# EAGLE design supply (EAGLE 9.6.2)
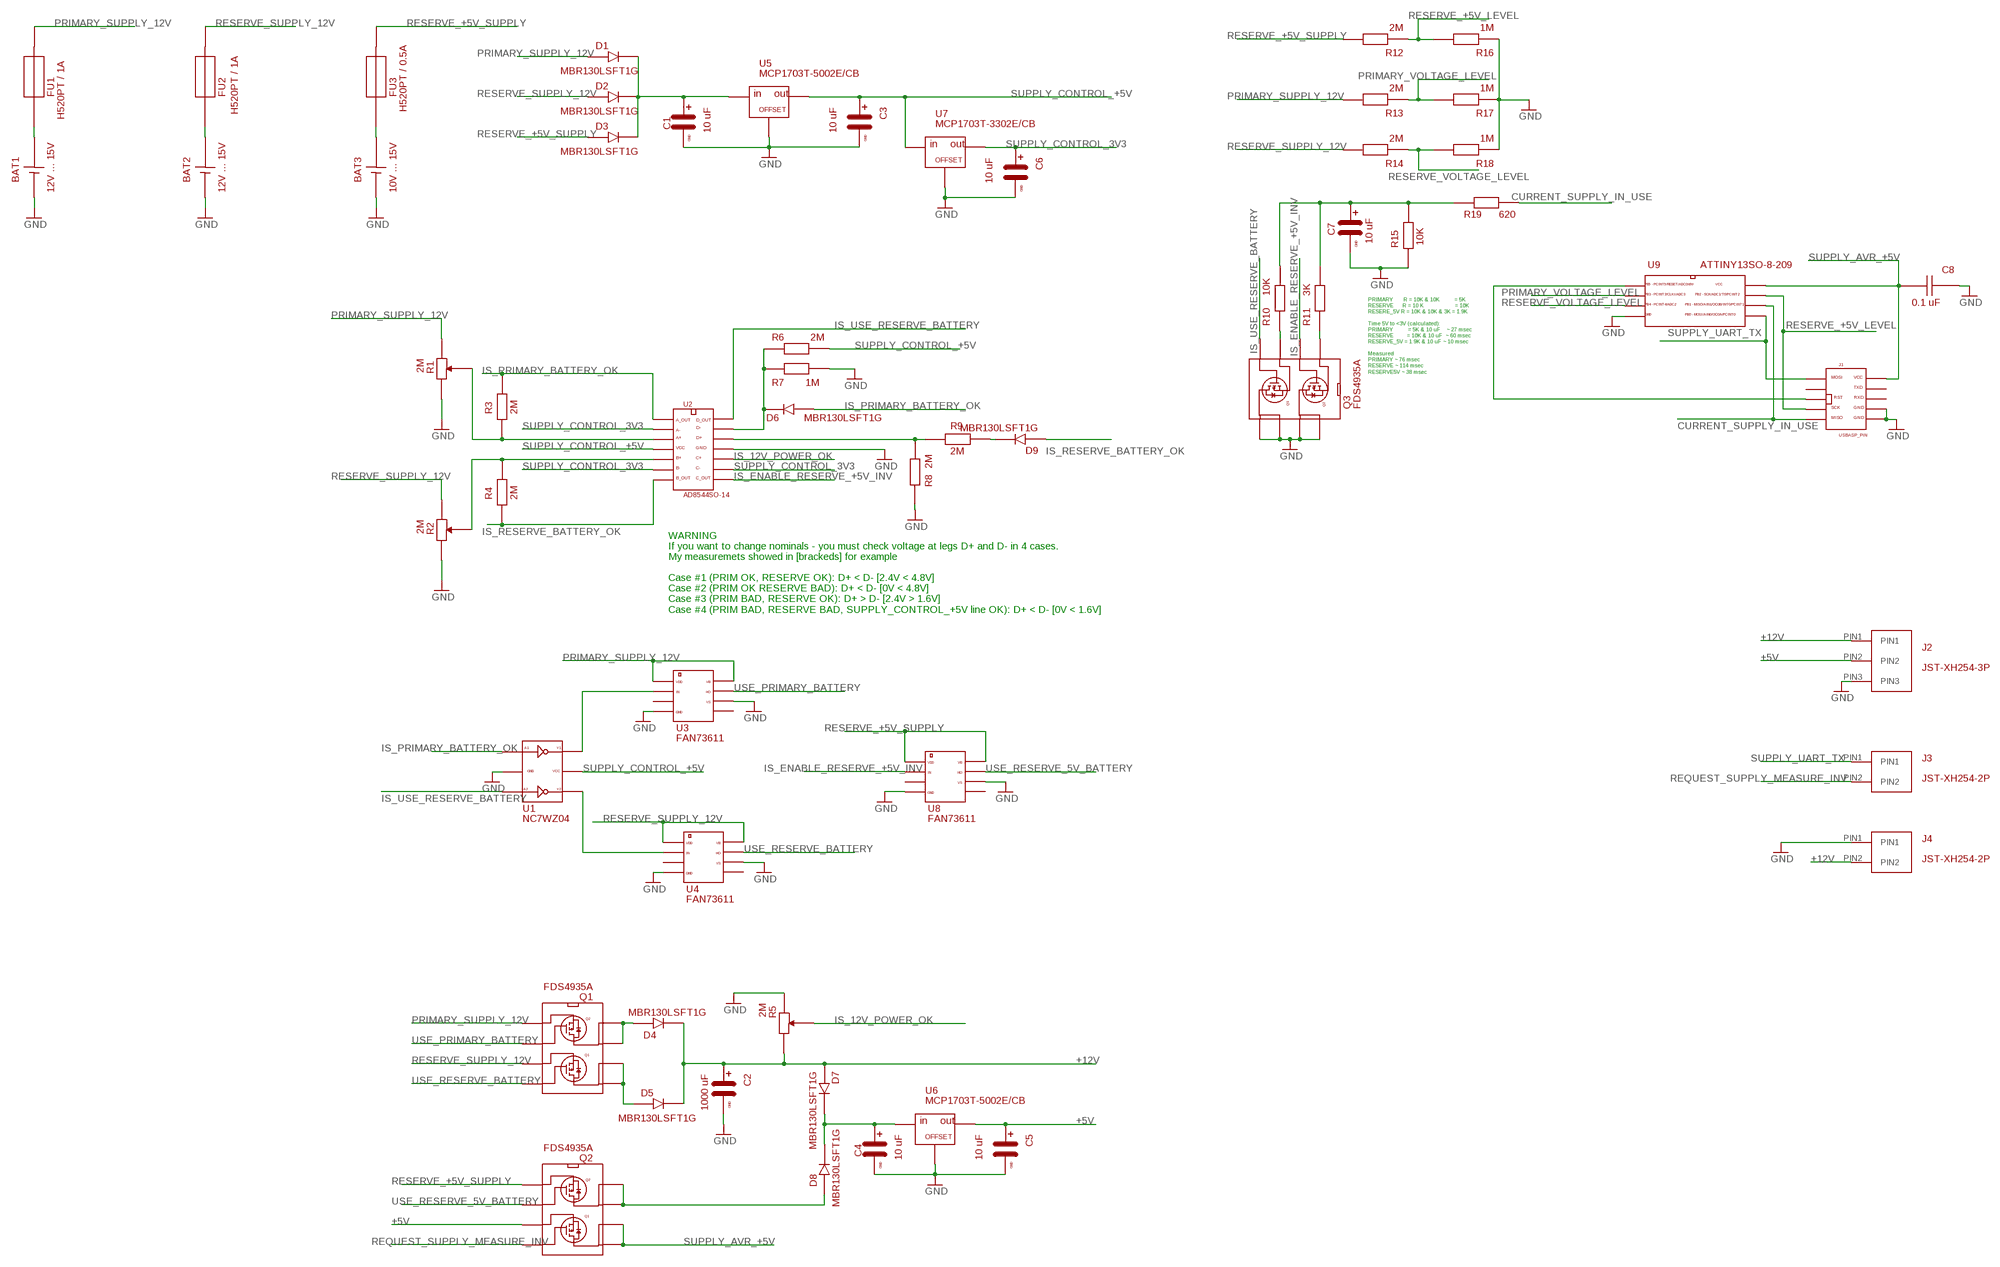
[diagram p0: schematic, sheet 1]

## Parts
BAT1  12V ... 15V  BATTERY  [BATTERY]
BAT2  12V ... 15V  BATTERY  [BATTERY]
BAT3  10V ... 15V  BATTERY  [BATTERY]
C1  10 uF  CMINI-5X7  [C-MINI-5X7]
C2  1000 uF  C  [C]
C3  10 uF  CMINI-5X7  [C-MINI-5X7]
C4  10 uF  CMINI-5X7  [C-MINI-5X7]
C5  10 uF  CMINI-5X7  [C-MINI-5X7]
C6  10 uF  CMINI-5X7  [C-MINI-5X7]
C7  10 uF  CMINI-5X7  [C-MINI-5X7]
C8  0.1 uF  C-1  [C-1]
D1  MBR130LSFT1G  DSOD-123FL  [D-SOD-123FL]
D2  MBR130LSFT1G  DSOD-123FL  [D-SOD-123FL]
D3  MBR130LSFT1G  DSOD-123FL  [D-SOD-123FL]
D4  MBR130LSFT1G  DSOD-123FL  [D-SOD-123FL]
D5  MBR130LSFT1G  DSOD-123FL  [D-SOD-123FL]
D6  MBR130LSFT1G  DSOD-123FL  [D-SOD-123FL]
D7  MBR130LSFT1G  DSOD-123FL  [D-SOD-123FL]
D8  MBR130LSFT1G  DSOD-123FL  [D-SOD-123FL]
D9  MBR130LSFT1G  DSOD-123FL  [D-SOD-123FL]
FU1  H520PT / 1A  FU  [FU]
FU2  H520PT / 1A  FU  [FU]
FU3  H520PT / 0.5A  FU  [FU]
J1  USBASP_PIN  [USBASP_PIN]
J2  JST-XH254-3P  [JST-XH254-3P]
J3  JST-XH254-2P  [JST-XH254-2P]
J4  JST-XH254-2P  [JST-XH254-2P]
Q1  FDS4935A  MOSFET_P_X2  [SO-8]
Q2  FDS4935A  MOSFET_P_X2  [SO-8]
Q3  FDS4935A  MOSFET_P_X2  [SO-8]
R1  2M  RD3296W-1-205LF  [RD-3296W-1-205LF]
R2  2M  RD3296W-1-205LF  [RD-3296W-1-205LF]
R3  2M  R  [R]
R4  2M  R  [R]
R5  2M  RD3296W-1-205LF  [RD-3296W-1-205LF]
R6  2M  R  [R]
R7  1M  R  [R]
R8  2M  R  [R]
R9  2M  R  [R]
R10  10K  R  [R]
R11  3K  R  [R]
R12  2M  R  [R]
R13  2M  R  [R]
R14  2M  R  [R]
R15  10K  R  [R]
R16  1M  R  [R]
R17  1M  R  [R]
R18  1M  R  [R]
R19  620  R  [R]
U1  NC7WZ04  INVERTER._X2  [SC70]
U2  AD8544SO-14  [SO-14]
U3  FAN73611  [SOIC-8]
U4  FAN73611  [SOIC-8]
U5  MCP1703T-5002E/CB  VOLTAGE_REGULATORSOT-23A  [SOT-23A]
U6  MCP1703T-5002E/CB  VOLTAGE_REGULATORSOT-23A  [SOT-23A]
U7  MCP1703T-3302E/CB  VOLTAGE_REGULATORSOT-23A  [SOT-23A]
U8  FAN73611  [SOIC-8]
U9  ATTINY13SO-8-209  [SO-8-209]

## Nets
+5V: C5.PLUS(PIN_PLUS) J2.PIN2 Q2.P3(S1) U6.P2(OUT)
+12V: C2.PIN_PLUS D4.CATHODE D5.CATHODE D7.ANODE J2.PIN1 J4.PIN2 R5.P2
BAT1: BAT1.PLUS FU1.P$1
BAT2: BAT2.PLUS FU2.P$1
BAT3: BAT3.PLUS FU3.P$1
CURRENT_SUPPLY_IN_USE: J1.MISO R19.P$2 U9.P6(PB1)
GND: BAT1.MINUS BAT2.MINUS BAT3.MINUS C1.MINUS(PIN_GND) C2.PIN_GND C3.MINUS(PIN_GND) C4.MINUS(PIN_GND) C5.MINUS(PIN_GND) C6.MINUS(PIN_GND) C7.MINUS(PIN_GND) C8.P$2 J1.GND J1.GND1 J2.PIN3 J4.PIN1 Q3.P5(D11) Q3.P6(D12) Q3.P7(D21) Q3.P8(D22) R1.P2 R2.P2 R5.P1 R7.P$1 R8.P$2 R15.P$1 R16.P$1 R17.P$1 R18.P$1 U1.P2(GND) U2.P11(GND) U3.P_4(GND) U3.P_6(VS) U4.P_4(GND) U4.P_6(VS) U5.P1(GND) U6.P1(GND) U7.P1(GND) U8.P_4(GND) U8.P_6(VS) U9.P4(GND)
IS_12V_POWER_OK: R5.P3 U2.P10(C+)
IS_ENABLE_RESERVE_+5V_INV: Q3.P2(G2) U2.P8(C_OUT) U8.P_2(IN)
IS_PRIMARY_BATTERY_OK: D6.ANODE R3.P$2 U1.P1(A1) U2.P1(A_OUT)
IS_RESERVE_BATTERY_OK: D9.ANODE R4.P$1 U2.P7(B_OUT)
IS_USE_RESERVE_BATTERY: Q3.P4(G1) U1.P3(A2) U2.P14(D_OUT)
N$1: C1.PLUS(PIN_PLUS) D1.CATHODE D2.CATHODE D3.CATHODE U5.P3(IN)
N$2: D6.CATHODE R6.P$2 R7.P$2 U2.P13(D-)
N$3: R1.P3 R3.P$1 U2.P3(A+)
N$5: C4.PLUS(PIN_PLUS) D7.CATHODE D8.CATHODE U6.P3(IN)
N$8: R2.P3 R4.P$2 U2.P5(B+)
N$9: R8.P$1 R9.P$1 U2.P12(D+)
N$12: D4.ANODE Q1.P7(D21) Q1.P8(D22)
N$13: D5.ANODE Q1.P5(D11) Q1.P6(D12)
N$17: J1.RST(RESET) U9.P1(PB5)
N$18: U1.P6(Y1) U3.P_2(IN)
N$19: U1.P4(Y2) U4.P_2(IN)
N$25: Q3.P3(S1) R10.P$1
N$26: D8.ANODE Q2.P7(D21) Q2.P8(D22)
N$27: Q3.P1(S2) R11.P$1
N$28: D9.CATHODE R9.P$2
N$29: C7.PLUS(PIN_PLUS) R10.P$2 R11.P$2 R15.P$2 R19.P$1
PRIMARY_SUPPLY_12V: D1.ANODE FU1.P$2 Q1.P1(S2) R1.P1 R13.P$2 U3.P_1(VDD) U3.P_8(VB)
PRIMARY_VOLTAGE_LEVEL: R13.P$1 R17.P$2 U9.P2(PB3)
REQUEST_SUPPLY_MEASURE_INV: J3.PIN2 Q2.P4(G1)
RESERVE_+5V_LEVEL: J1.SCK R12.P$1 R16.P$2 U9.P7(PB2)
RESERVE_+5V_SUPPLY: D3.ANODE FU3.P$2 Q2.P1(S2) R12.P$2 U8.P_1(VDD) U8.P_8(VB)
RESERVE_SUPPLY_12V: D2.ANODE FU2.P$2 Q1.P3(S1) R2.P1 R14.P$2 U4.P_1(VDD) U4.P_8(VB)
RESERVE_VOLTAGE_LEVEL: R14.P$1 R18.P$2 U9.P3(PB4)
SUPPLY_AVR_+5V: C8.P$1 J1.VCC Q2.P5(D11) Q2.P6(D12) U9.P8(VCC)
SUPPLY_CONTROL_3V3: C6.PLUS(PIN_PLUS) U2.P2(A-) U2.P6(B-) U2.P9(C-) U7.P2(OUT)
SUPPLY_CONTROL_+5V: C3.PLUS(PIN_PLUS) R6.P$1 U1.P5(VCC) U2.P4(VCC) U5.P2(OUT) U7.P3(IN)
SUPPLY_UART_TX: J1.MOSI J3.PIN1 U9.P5(PB0)
USE_PRIMARY_BATTERY: Q1.P2(G2) U3.P_7(HO)
USE_RESERVE_5V_BATTERY: Q2.P2(G2) U8.P_7(HO)
USE_RESERVE_BATTERY: Q1.P4(G1) U4.P_7(HO)
Unconnected: J1.NC1 J1.RXD J1.TXD U3.P_3(NC1) U3.P_5(NC2) U4.P_3(NC1) U4.P_5(NC2) U8.P_3(NC1) U8.P_5(NC2)

## Notes on the sheet
- PRIMARY       R = 10K & 10K          = 5K
  RESERVE      R = 10 K                     = 10K
  RESERE_5V R = 10K & 10K & 3K = 1.9K
  
  Time 5V to <3V (calculated): 
  PRIMARY          = 5K & 10 uF    ~ 27 msec
  RESERVE         = 10K & 10 uF  ~ 60 msec
  RESERVE_5V = 1.9K & 10 uF ~ 10 msec
  
  Measured
  PRIMARY ~ 76 msec
  RESERVE ~ 114 msec
  RESERVE5V ~ 38 msec
- WARNING
  If you want to change nominals - you must check voltage at legs D+ and D- in 4 cases.
  My measuremets showed in [brackeds] for example
  
  Case #1 (PRIM OK, RESERVE OK): D+ < D- [2.4V < 4.8V]
  Case #2 (PRIM OK RESERVE BAD): D+ < D- [0V < 4.8V]
  Case #3 (PRIM BAD, RESERVE OK): D+ > D- [2.4V > 1.6V]
  Case #4 (PRIM BAD, RESERVE BAD, SUPPLY_CONTROL_+5V line OK): D+ < D- [0V < 1.6V]

## Library data of the parts
BAT1-BAT3 = my_devices:BATTERY
C1-C7 = my_devices:C
C8 = my_devices:C-1
D1-D9 = my_devices:D
FU1-FU3 = my_devices:FU
J1 = my_devices:USBASP_PIN
J2 = my_devices:JST-XH254-3P
J3 J4 = my_devices:JST-XH254-2P
Q1-Q3 = my_devices:MOSFET_P_X2
R1 R2 R5 = my_devices:RD
R3 R4 R6-R19 = my_devices:R
U1 = my_devices:INVERTER._X2
U2 = my_devices:AD8544
U3 U4 U8 = my_devices:FAN73611
U5-U7 = my_devices:VOLTAGE_REGULATOR
U9 = my_devices:ATTINY13

## Board
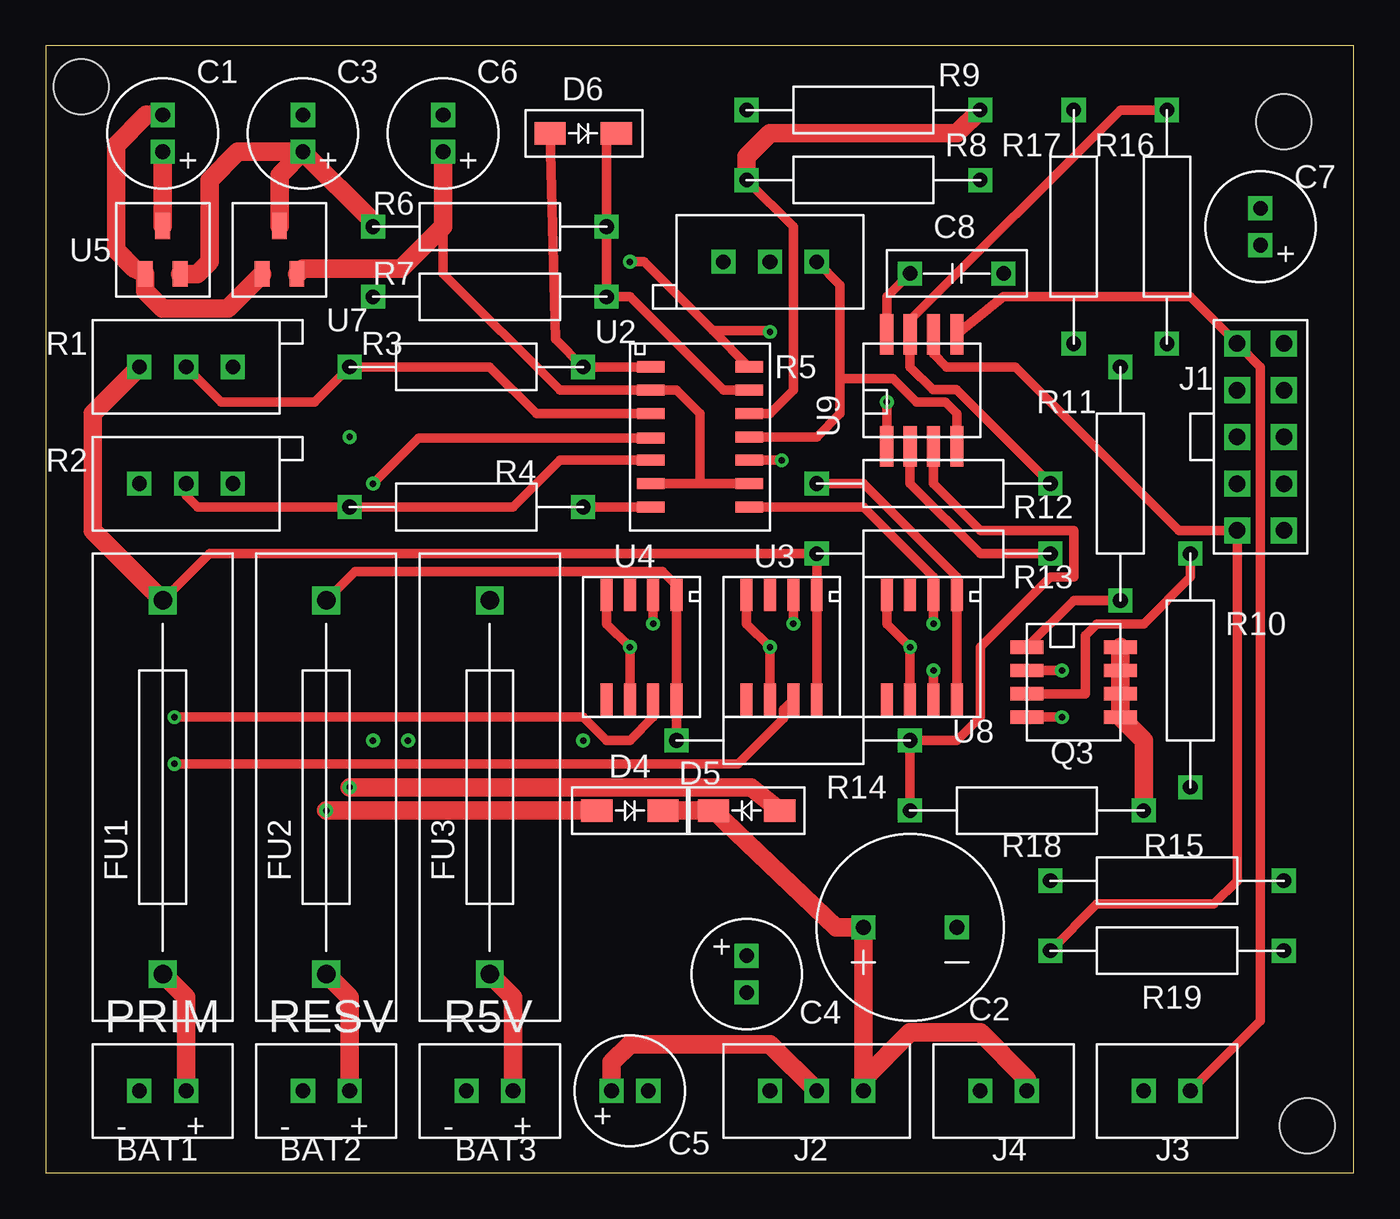
[diagram p1: board, top side]
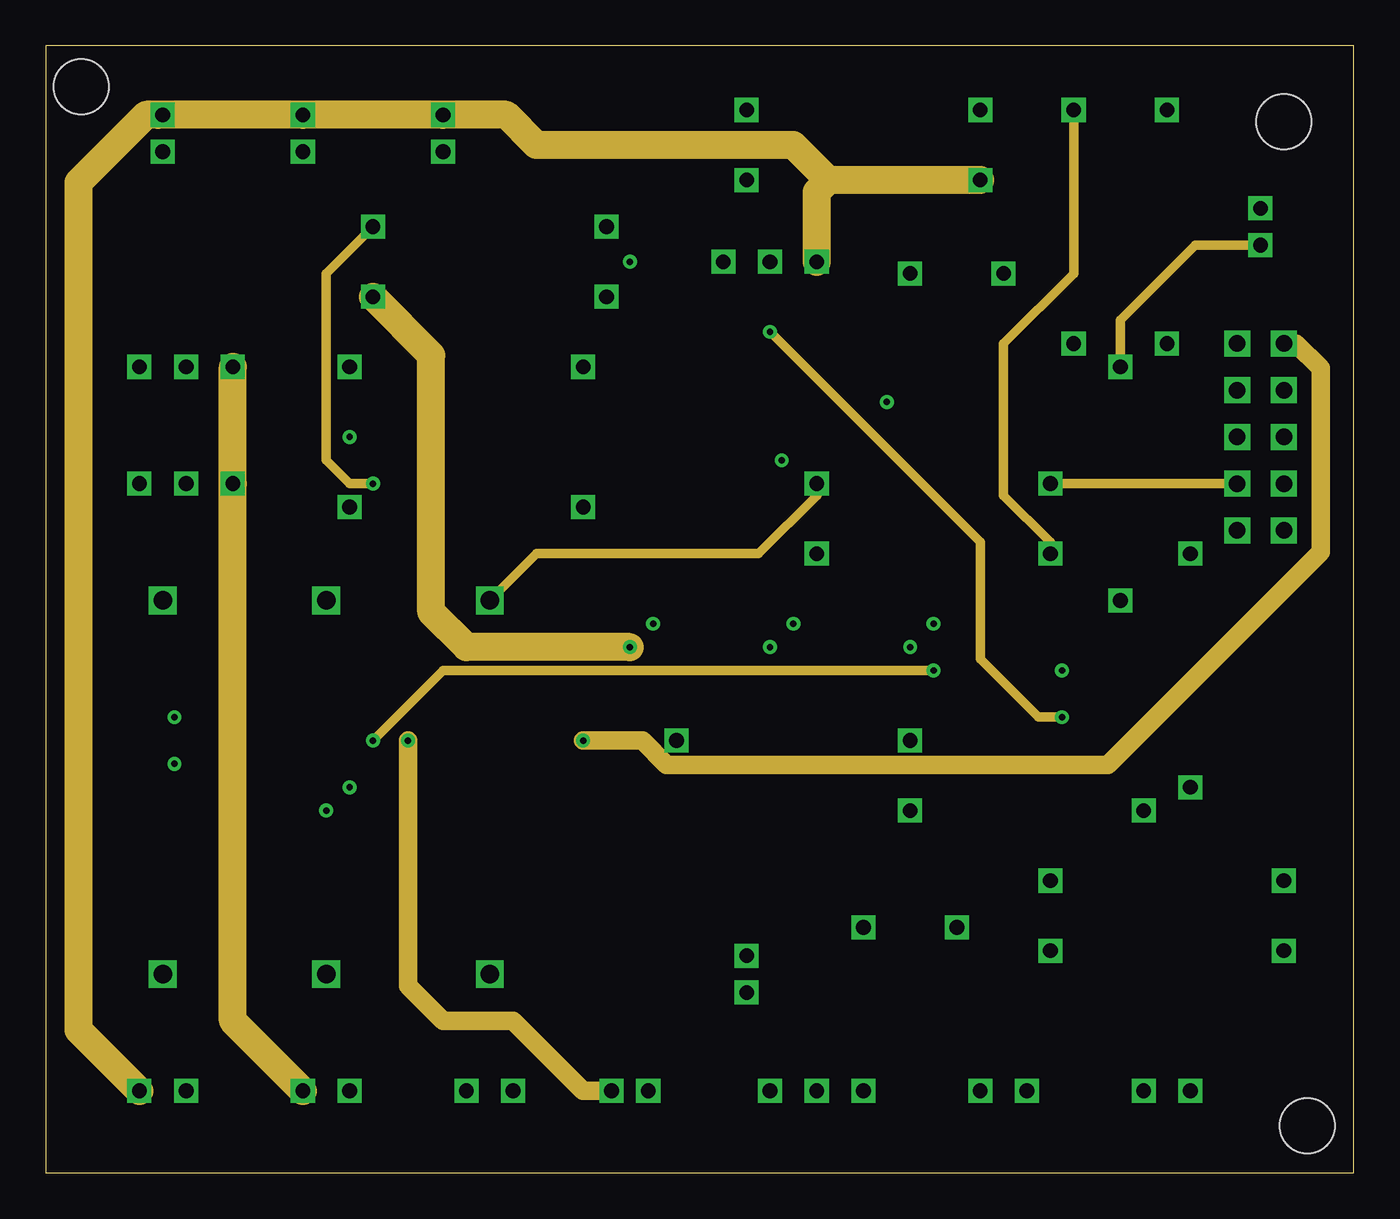
[diagram p2: board, inner layer Route2]
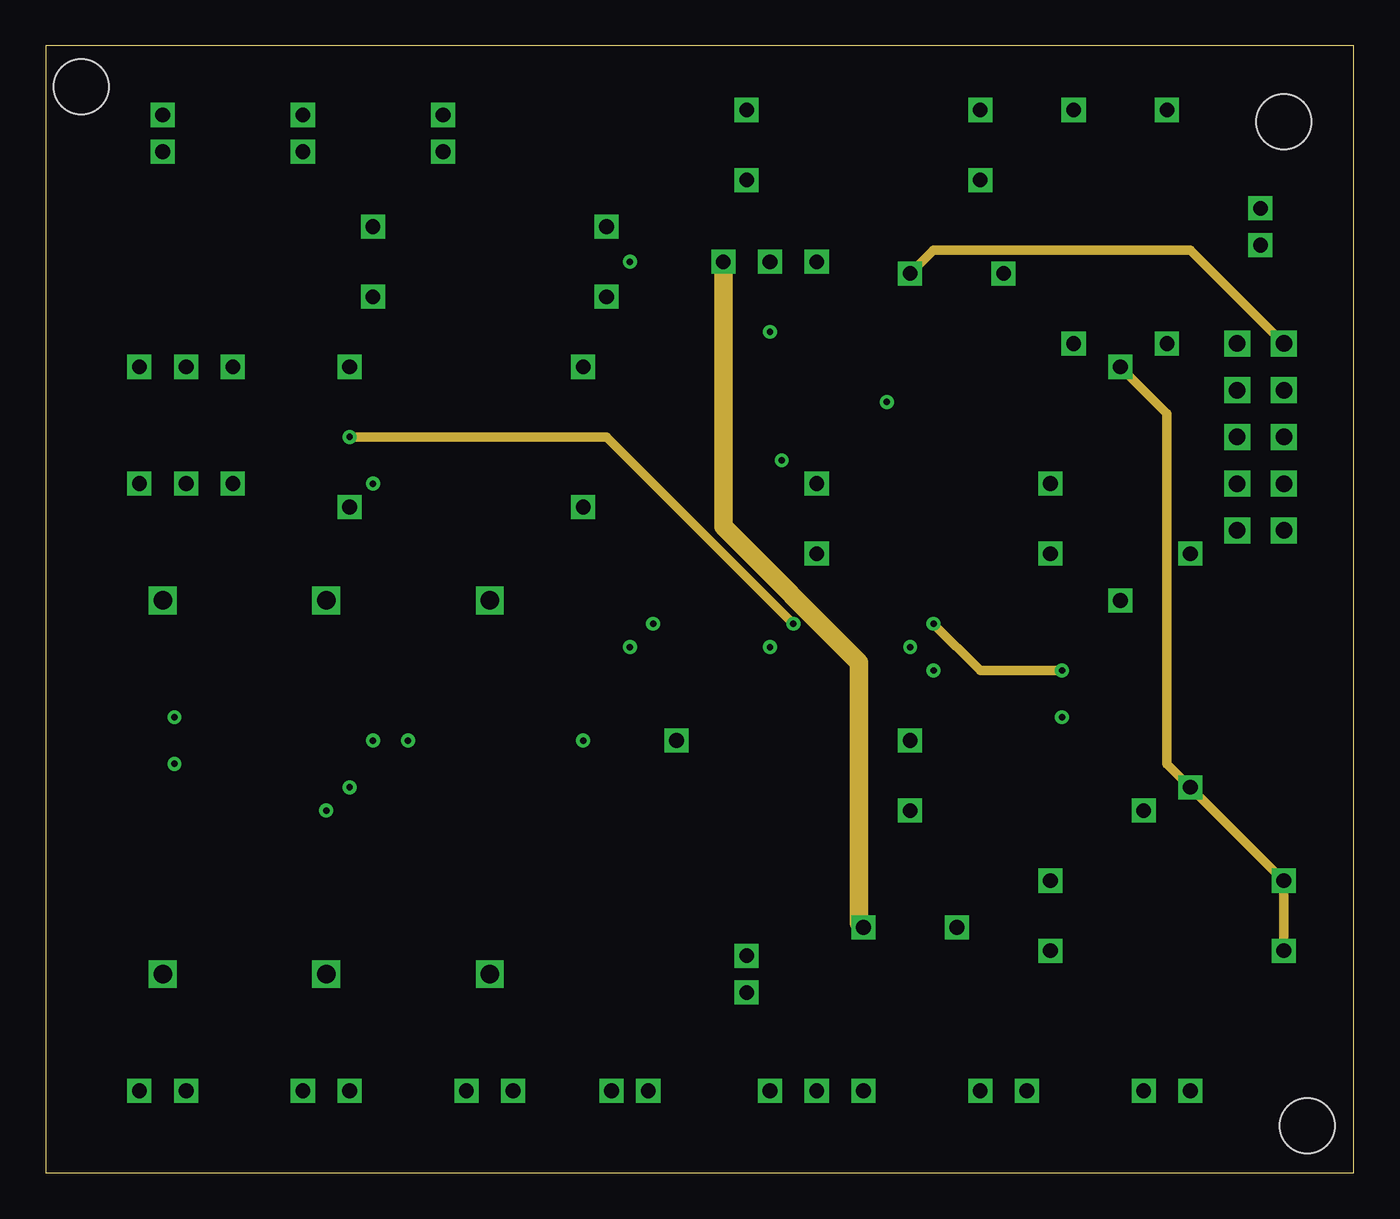
[diagram p3: board, inner layer Route15]
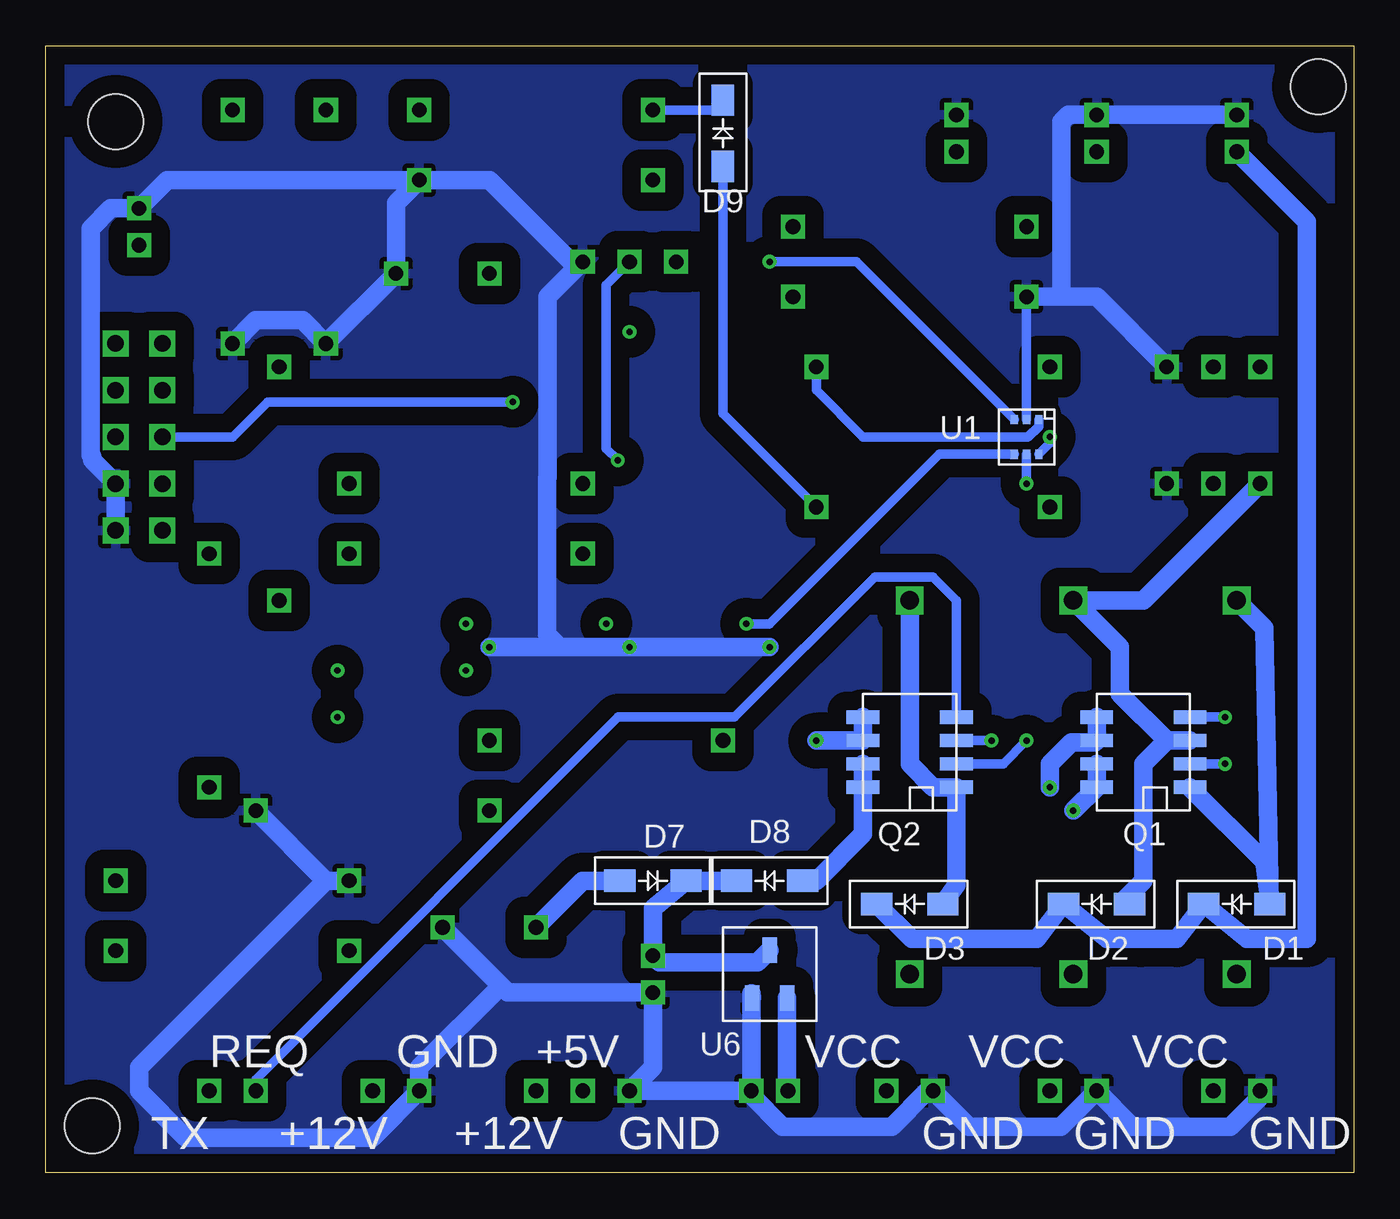
[diagram p4: board, bottom side, seen from below]

Size 71.1 x 61.27 mm. Coordinates in mm from the lower left corner, seen from the top.
Outline: 0,0 71.1,0 71.1,61.27 0,61.27 0,0
Copper layers (1+2*15+16): Top 0.035mm / dielectric 1.5mm / Route2 0.035mm / dielectric 0.15mm / Route15 0.035mm / dielectric 0.2mm / Bottom 0.035mm
Design rules "default *": minimum track width 6mil, minimum drill 0.35mm, track to track 6mil, track to pad 6mil, pad to pad 6mil, via to via 6mil, smd to smd 6mil, copper to edge 40mil, drill to drill 6mil, minimum pad ring 10mil, minimum via ring 8mil, stop-mask expansion 4mil, vias tented up to drill 0mil, thermal gap 10mil
Holes 3 mm at 1.9,59.05 67.31,57.15 68.58,2.54

### Footprints (pad centres in the part's own frame; a part is rotated, then mirrored left to right if it is on the bottom)
BATTERY = drill 0.8 square: MINUS -1.27,0; PLUS 1.27,0
C-MINI-5X7 = drill 0.8 square: MINUS 1,0; PLUS -1,0
C = drill 0.8 square: PIN_GND 2.54,0; PIN_PLUS -2.54,0
C-1 = drill 0.8 square: P$1 -2.54,0; P$2 2.54,0
D-SOD-123FL = smd 1.7 x 1.22: ANODE -1.8,0; CATHODE 1.8,0
FU = drill 1 square: P$1 -10.16,0; P$2 10.16,0
USBASP_PIN = drill 0.9 square: GND 1.27,-2.54; GND1 1.27,-5.08; MISO -1.27,-5.08; MOSI -1.27,5.08; NC1 -1.27,2.54; RST -1.27,0; RXD 1.27,0; SCK -1.27,-2.54; TXD 1.27,2.54; VCC 1.27,5.08
JST-XH254-3P = drill 0.8 square: PIN1 -2.54,0; PIN2 0,0; PIN3 2.54,0
JST-XH254-2P = drill 0.8 square: PIN1 -1.27,0; PIN2 1.27,0
SO-8 = smd 1.78 x 0.72: P1 -2.54,2.54; P2 -2.54,1.27; P3 -2.54,0; P4 -2.54,-1.27; P5 2.54,-1.27; P6 2.54,0; P7 2.54,1.27; P8 2.54,2.54
RD-3296W-1-205LF = drill 0.8 square: P1 -2.54,0; P2 2.54,0; P3 0,0
R = drill 0.8 square: P$1 -6.35,0; P$2 6.35,0
SC70 = smd 0.5 x 0.4: P1 -0.94,0.67; P2 -0.94,0; P3 -0.94,-0.67; P4 0.94,-0.67; P5 0.94,0; P6 0.94,0.67
SO-14 = smd 1.5 x 0.6: P1 -2.67,3.81; P2 -2.67,2.54; P3 -2.67,1.27; P4 -2.67,-0.05; P5 -2.67,-1.27; P6 -2.67,-2.54; P7 -2.67,-3.81; P8 2.67,-3.81; P9 2.67,-2.54; P10 2.67,-1.27; P11 2.67,0; P12 2.67,1.27; P13 2.67,2.54; P14 2.67,3.81
SOIC-8 = smd 1.75 x 0.65: P_1 -2.84,1.27; P_2 -2.84,0; P_3 -2.84,-1.27; P_4 -2.84,-2.54; P_5 2.84,-2.54; P_6 2.84,-1.27; P_7 2.84,0; P_8 2.84,1.27
SOT-23A = smd 0.8 x 1.4: P1 -0.95,-1.3; P2 0.95,-1.3; P3 0,1.3
SO-8-209 = smd 2.2 x 0.72: P1 -3.04,2.54; P2 -3.04,1.27; P3 -3.04,0; P4 -3.04,-1.27; P5 3.04,-1.27; P6 3.04,0; P7 3.04,1.27; P8 3.04,2.54

### Placement (x,y rotation side)
BAT1  6.35,4.45 0 top
BAT2  15.24,4.45 0 top
BAT3  24.13,4.45 0 top
C1  6.35,56.52 90 top
C2  46.99,13.34 0 top
C3  13.97,56.52 90 top
C4  38.1,10.79 270 top
C5  31.75,4.45 0 top
C6  21.59,56.52 90 top
C7  66.04,51.44 90 top
C8  49.53,48.89 0 top
D1  6.35,14.61 180 bottom
D2  13.97,14.61 180 bottom
D3  24.13,14.61 180 bottom
D4  31.75,19.68 0 top
D5  38.1,19.68 180 top
D6  29.21,56.52 0 top
D7  38.1,15.88 0 bottom
D8  31.75,15.88 180 bottom
D9  34.29,56.52 90 bottom
FU1  6.35,20.96 90 top
FU2  15.24,20.96 90 top
FU3  24.13,20.96 90 top
J1  66.04,40 0 top
J2  41.91,4.45 180 top
J3  60.96,4.45 180 top
J4  52.07,4.45 0 top
Q1  11.43,23.5 180 bottom
Q2  24.13,23.5 180 bottom
Q3  55.88,26.04 0 top
R1  7.62,43.81 0 top
R2  7.62,37.47 0 top
R3  22.86,43.81 0 top
R4  22.86,36.19 180 top
R5  39.37,49.53 180 top
R6  24.13,51.44 0 top
R7  24.13,47.62 0 top
R8  44.45,53.97 0 top
R9  44.45,57.78 180 top
R10  62.23,27.3 270 top
R11  58.42,37.47 90 top
R12  48.26,37.47 180 top
R13  48.26,33.66 180 top
R14  40.64,23.5 180 top
R15  60.96,15.88 0 top
R16  60.96,51.44 90 top
R17  55.88,51.44 90 top
R18  53.34,19.68 180 top
R19  60.96,12.07 180 top
U1  17.78,40 270 bottom
U2  35.56,40 0 top
U3  40.64,28.57 270 top
U4  33.02,28.57 270 top
U5  6.35,50.16 0 top
U6  31.75,10.79 0 bottom
U7  12.7,50.16 0 top
U8  48.26,28.57 270 top
U9  48.26,42.55 90 top

### Tracks (layer width: path | path; a pad name or v marks a point on that pad's centre or on a via)
+5V  (via drill 0.35)
  Top 1.016: C5.PLUS 30.75,5.98 31.75,6.98 39.37,6.98 J2.PIN2
  Route2 1.016: C5.PLUS 29.21,4.45 25.4,8.25 21.59,8.25 19.68,10.16 v19.68,23.5
  Bottom 0.508: Q2.P3 v19.68,23.5
  Bottom 1.016: U6.P2 30.8,4.5 C5.PLUS
+12V
  Top 1.016: D4.CATHODE D5.CATHODE 42.95,13.34 C2.PIN_PLUS J2.PIN1 44.45,5.08 46.99,7.62 50.8,7.62 53.34,5.08 J4.PIN2
  Route15 1.016: R5.P2 36.83,35.12 44.22,27.74 44.22,13.57 C2.PIN_PLUS
  Bottom 1.016: D7.ANODE 41.91,15.88 C2.PIN_PLUS
BAT1
  Top 1.016: FU1.P$1 7.62,9.52 BAT1.PLUS
BAT2
  Top 1.016: BAT2.PLUS 16.51,9.52 FU2.P$1
BAT3
  Top 1.016: BAT3.PLUS 25.4,9.52 FU3.P$1
CURRENT_SUPPLY_IN_USE
  Top 0.508: R19.P$2 57.15,14.61 63.5,14.61 64.77,15.88 J1.MISO 61.59,34.92 52.7,43.81 48.98,43.81 48.26,44.53 U9.P6
GND  (via drill 0.35)
  Top 0.508: U4.P_4 30.48,29.85 v31.75,28.57 U4.P_6 | U3.P_4 38.1,29.85 v39.37,28.57 U3.P_6 | U8.P_4 45.72,29.85 v46.99,28.57 U8.P_6 | R5.P1 43.18,48.26 43.18,43.18 | U2.P11 41.91,40 43.18,41.28 43.18,43.18 | U9.P4 49.53,41.28 48.89,41.91 47.33,41.91 46.06,43.18 43.18,43.18
  Top 1.016: U5.P1 5.4,48.58 | U5.P1 4.81,49.17 3.81,50.16 3.81,55.88 5.45,57.52 C1.MINUS | Q3.P8 Q3.P7 Q3.P6 Q3.P5 59.69,23.5 R18.P$1 | U5.P1 5.4,47.94 6.35,46.99 9.88,46.99 U7.P1
  Route2 1.016: 6.08,57.52 C1.MINUS
  Route2 1.524: R8.P$2 42.55,53.97 | 42.55,53.97 40.64,55.88 26.67,55.88 25.03,57.52 C6.MINUS C3.MINUS 6.08,57.52 5.45,57.52 1.78,53.85 1.78,7.75 BAT1.MINUS | R5.P1 41.91,53.34 42.55,53.97 | BAT2.MINUS 10.16,8.25 R2.P2 R1.P2 | v31.75,28.57 22.86,28.57 20.95,30.48 20.95,44.45 R7.P$1
  Bottom 0.508: R7.P$1 U1.P2
  Bottom 1.016: BAT1.MINUS 5.08,4.11 6.69,2.5 12.02,2.5 BAT2.MINUS 15.92,2.5 20.91,2.5 BAT3.MINUS 23.16,4.45 25.11,2.5 31.04,2.5 32.75,4.2 C5.MINUS | C5.MINUS J2.PIN3 38.1,5.71 C4.MINUS 45.99,9.79 46.35,10.16 | U6.P1 32.75,9.75 C5.MINUS | 46.35,10.16 C2.PIN_GND | R7.P$1 15.88,47.62 | 15.88,47.62 13.97,47.62 R1.P2 | R8.P$2 46.99,53.97 42.55,49.53 R5.P1 43.81,47.62 43.81,37.8 43.86,37.76 43.86,29.25 43.18,28.57 | v31.75,28.57 v39.37,28.57 43.18,28.57 | 43.18,28.57 v46.99,28.57 | R8.P$2 52.07,52.7 C8.P$2 R17.P$1 57.15,46.36 59.69,46.36 R16.P$1 | R8.P$2 64.5,53.97 C7.MINUS 67.58,52.44 68.67,51.34 68.67,39.03 68.58,38.93 68.58,38.73 J1.GND J1.GND1 | 55.88,15.88 66.04,5.71 66.04,4.45 63.5,1.91 53.34,1.91 J4.PIN1 50.8,5.71 46.35,10.16 | R15.P$1 55.88,15.88 | 55.88,15.88 R18.P$1 | C1.MINUS C3.MINUS 15.51,57.52 15.88,57.15 15.88,47.62
  pour Bottom (isolate 1.016): 0,60.96 71.12,60.96 71.12,0 0,0
IS_12V_POWER_OK  (via drill 0.35)
  Top 0.508: U2.P10 v40.01,38.73
  Bottom 0.508: R5.P3 40.64,48.26 40.64,39.37 v40.01,38.73
IS_ENABLE_RESERVE_+5V_INV  (via drill 0.35)
  Top 0.508: U2.P8 44.45,36.19 48.26,32.39 U8.P_2 v48.26,29.85 | Q3.P2 v55.25,27.3
  Route15 0.508: v48.26,29.85 50.8,27.3 v55.25,27.3
IS_PRIMARY_BATTERY_OK
  Top 0.508: U2.P1 R3.P$2 27.71,45.31 D6.ANODE
  Bottom 0.508: U1.P1 17.12,40.58 17.7,40 26.67,40 29.21,42.55 R3.P$2
IS_RESERVE_BATTERY_OK
  Top 0.508: U2.P7 R4.P$1
  Bottom 0.508: D9.ANODE 34.29,41.28 R4.P$1
IS_USE_RESERVE_BATTERY  (via drill 0.35)
  Top 0.508: U2.P14 36.26,45.78 | 36.26,45.78 32.52,49.53 v31.75,49.53 | v39.37,45.72 39.3,45.78 36.26,45.78 | Q3.P4 v55.25,24.76
  Route2 0.508: v39.37,45.72 50.8,34.29 50.8,27.94 53.98,24.76 v55.25,24.76
  Bottom 0.508: U1.P3 27.03,49.53 v31.75,49.53
N$1
  Top 1.016: U5.P3 C1.PLUS
  Bottom 1.016: 11.57,12.7 | 11.57,12.7 13.41,12.7 D2.CATHODE 17.22,12.7 22.89,12.7 | 11.57,12.7 9.61,12.7 D1.CATHODE 5.79,12.7 2.54,12.7 2.54,51.7 C1.PLUS | 22.89,12.7 | D3.CATHODE 24.02,12.7 22.89,12.7
N$2
  Top 0.508: U2.P13 36.83,42.55 31.75,47.62 R7.P$2 R6.P$2 30.48,56.28 D6.CATHODE
N$3
  Top 0.508: U2.P3 26.67,41.28 24.13,43.81 R3.P$1 14.61,41.91 9.52,41.91 R1.P3
N$5
  Bottom 1.016: D8.CATHODE D7.CATHODE 38.1,14.38 C4.PLUS 37.73,11.43 32.41,11.43 U6.P3
N$8
  Top 0.508: U2.P5 27.94,38.73 25.4,36.19 R4.P$2 8.25,36.19 7.62,36.83 R2.P3
N$9
  Top 0.508: U2.P12 39.37,41.28 40.64,42.55 40.64,51.44 R8.P$1
  Top 1.016: R9.P$1 49.53,56.52 39.37,56.52 38.1,55.24 R8.P$1
N$12  (via drill 0.35)
  Top 1.016: D4.ANODE v15.24,19.68
  Bottom 1.016: Q1.P7 Q1.P8 v15.24,19.68
N$13  (via drill 0.35)
  Top 1.016: 29.35,20.96 | 29.35,20.96 v16.51,20.96 | D5.ANODE 38.33,20.96 29.35,20.96
  Bottom 1.016: Q1.P5 Q1.P6 14.07,23.39 15.34,23.39 16.51,22.22 v16.51,20.96
N$17  (via drill 0.35)
  Top 0.508: U9.P1 v45.72,41.91
  Bottom 0.508: J1.RST 60.96,40 59.05,41.91 v45.72,41.91
N$18  (via drill 0.35)
  Top 0.508: U3.P_2 v40.64,29.85
  Route15 0.508: v16.51,40 30.48,40 v40.64,29.85
  Bottom 0.508: U1.P6 16.51,39.67 v16.51,40
N$19  (via drill 0.35)
  Top 0.508: U4.P_2 v33.02,29.85
  Bottom 0.508: U1.P4 22.53,39.06 31.75,29.85 v33.02,29.85
N$25
  Top 0.508: R10.P$1 62.23,32.39 59.69,29.85 57.15,29.85 56.52,29.21 56.52,26.04 Q3.P3
N$26
  Bottom 1.016: Q2.P7 Q2.P8 26.67,18.42 29.21,15.88 D8.ANODE
N$27
  Top 0.508: R11.P$1 55.88,31.11 Q3.P1
N$28
  Bottom 0.508: D9.CATHODE 34.52,57.78 R9.P$2
N$29
  Route2 0.508: R11.P$2 58.42,46.36 62.5,50.44 C7.PLUS
  Route15 0.508: R19.P$1 R15.P$2 R10.P$2 60.96,22.22 60.96,41.28 R11.P$2
PRIMARY_SUPPLY_12V
  Top 0.508: U3.P_8 U3.P_1 R13.P$2 8.89,33.66 FU1.P$2
  Top 1.016: FU1.P$2 2.54,34.92 2.54,41.28 R1.P1
  Bottom 1.016: FU1.P$2 4.85,29.61 D1.ANODE 4.85,16.91 Q1.P1
PRIMARY_VOLTAGE_LEVEL
  Top 0.508: U9.P2 46.99,37.47 50.8,33.66 R13.P$1
  Route2 0.508: R17.P$2 55.88,48.89 52.07,45.08 52.07,36.83 54.61,34.29 R13.P$1
REQUEST_SUPPLY_MEASURE_INV
  Bottom 0.508: Q2.P4 21.59,31.11 22.86,32.39 26.03,32.39 33.66,24.76 39.98,24.76 59.69,5.06 J3.PIN2
RESERVE_+5V_LEVEL
  Top 0.508: R16.P$2 58.42,57.78 46.99,46.36 U9.P7 46.99,43.81 48.23,42.57 49.51,42.57 R12.P$1
  Route2 0.508: R12.P$1 J1.SCK
RESERVE_+5V_SUPPLY
  Top 0.508: U8.P_8 U8.P_1 49.53,32.39 44.45,37.47 R12.P$2
  Route2 0.508: FU3.P$2 26.67,33.66 38.73,33.66 41.91,36.83 R12.P$2
  Bottom 1.016: FU3.P$2 24.13,22.22 22.86,20.96 Q2.P1 21.59,15.64 D3.ANODE
RESERVE_SUPPLY_12V
  Top 0.508: FU2.P$2 16.82,32.7 33.51,32.7 34.29,31.92 U4.P_1 U4.P_8 R14.P$2
  Bottom 1.016: D2.ANODE 12.47,14.84 11.43,15.88 11.43,22.22 10.16,23.5 | 10.16,23.5 Q1.P3 | 10.16,23.5 12.7,26.04 12.7,28.57 FU2.P$2 11.43,31.11 R2.P1
RESERVE_VOLTAGE_LEVEL
  Top 0.508: R18.P$2 R14.P$1 49.53,23.5 50.8,24.76 50.8,28.57 54.61,32.39 55.88,32.39 55.88,34.92 50.8,34.92 48.26,37.47 U9.P3
SUPPLY_AVR_+5V  (via drill 0.35)
  Top 0.508: U9.P8 45.72,47.62 C8.P$1
  Route2 1.016: J1.VCC 67.97,45.08 69.31,43.75 69.31,33.75 57.74,22.18 33.75,22.18 32.43,23.5 v29.21,23.5
  Route15 0.508: C8.P$1 48.26,50.16 62.23,50.16 J1.VCC
  Bottom 1.016: Q2.P5 Q2.P6 v29.21,23.5
SUPPLY_CONTROL_3V3
  Top 0.508: 21.59,51.44 21.59,48.89 27.94,42.55 U2.P2 34.29,42.55 35.56,41.28 35.56,37.47 | 35.56,37.47 U2.P6 | 35.56,37.47 U2.P9
  Top 1.016: C6.PLUS 21.59,51.44 19.32,49.17 13.95,49.17 U7.P2
SUPPLY_CONTROL_+5V  (via drill 0.35)
  Top 0.508: U2.P4 20.27,39.95 v17.78,37.47
  Top 1.016: U5.P2 8.22,48.86 8.89,49.53 8.89,53.97 10.43,55.52 C3.PLUS | C3.PLUS 17.78,51.7 R6.P$1 | U7.P3 12.7,54.24 C3.PLUS
  Route2 0.508: R6.P$1 15.24,48.89 15.24,38.73 16.51,37.47 v17.78,37.47
  Bottom 0.508: U1.P5 v17.78,37.47
SUPPLY_UART_TX
  Top 0.508: U9.P5 52.07,47.62 62.23,47.62 J1.MOSI 66.04,43.81 66.04,8.25 J3.PIN1
USE_PRIMARY_BATTERY  (via drill 0.35)
  Top 0.508: U3.P_7 40.1,25.2 40.1,24.69 37.63,22.22 v6.98,22.22
  Bottom 0.508: Q1.P2 v6.98,22.22
USE_RESERVE_5V_BATTERY  (via drill 0.35)
  Top 0.508: U8.P_7 v48.26,27.3
  Route2 0.508: v17.78,23.5 21.59,27.3 v48.26,27.3
  Bottom 0.508: Q2.P2 19.05,22.22 v17.78,23.5
USE_RESERVE_BATTERY  (via drill 0.35)
  Top 0.508: v6.98,24.76 29.21,24.76 30.48,23.5 31.75,23.5 33.02,24.76 U4.P_7
  Bottom 0.508: Q1.P4 v6.98,24.76

### Text on the board
tNames: PRIM | RESV | R5V
bNames: VCC | VCC | VCC | +5V | GND | REQ | GND | GND | GND | GND | +12V | +12V | TX